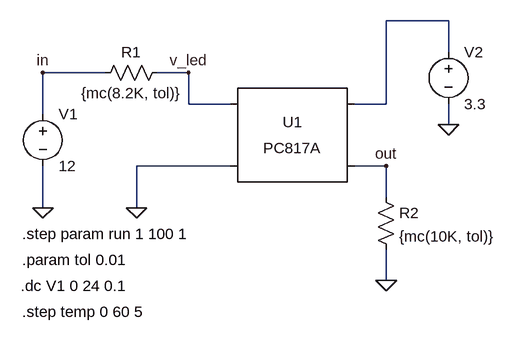
[diagram p0: schematic opto.asc]
opto.asc, the LTspice schematic file:
Version 4
SHEET 1 880 680
WIRE 448 -16 352 -16
WIRE 448 32 448 -16
WIRE -80 64 -176 64
WIRE 48 64 0 64
WIRE 48 112 48 64
WIRE 112 112 48 112
WIRE 352 112 352 -16
WIRE 352 112 304 112
WIRE -176 128 -176 64
WIRE 448 144 448 112
WIRE 112 208 -32 208
WIRE 352 208 304 208
WIRE 352 256 352 208
WIRE -176 272 -176 208
WIRE -32 272 -32 208
WIRE 352 384 352 336
FLAG -176 272 0
FLAG -32 272 0
FLAG 352 384 0
FLAG 448 144 0
FLAG 352 208 out
FLAG 48 64 v_led
FLAG -176 64 in
SYMBOL Optos\\PC817A 208 160 R0
SYMATTR InstName U1
SYMBOL voltage -176 112 R0
WINDOW 123 0 0 Left 0
WINDOW 39 0 0 Left 0
SYMATTR InstName V1
SYMATTR Value 12
SYMBOL res 16 48 R90
WINDOW 0 0 56 VBottom 2
WINDOW 3 32 56 VTop 2
SYMATTR InstName R1
SYMATTR Value {mc(8.2K, tol)}
SYMBOL res 336 240 R0
SYMATTR InstName R2
SYMATTR Value {mc(10K, tol)}
SYMBOL voltage 448 16 R0
WINDOW 123 0 0 Left 0
WINDOW 39 0 0 Left 0
SYMATTR InstName V2
SYMATTR Value 3.3
TEXT -210 392 Left 2 !.dc V1 0 24 0.1
TEXT -208 432 Left 2 !.step temp 0 60 5
TEXT -208 352 Left 2 !.param tol 0.01
TEXT -208 312 Left 2 !.step param run 1 100 1

The netlist it stands for:
* opto.asc
XU1 v_led 0 N001 out PC817 Igain=1m
V1 in 0 12
R1 v_led in {mc(8.2K, tol)}
R2 out 0 {mc(10K, tol)}
V2 N001 0 3.3
.dc V1 0 24 0.1
.step temp 0 60 5
.param tol 0.01
.step param run 1 100 1
.lib PC817.sub
.backanno
.end